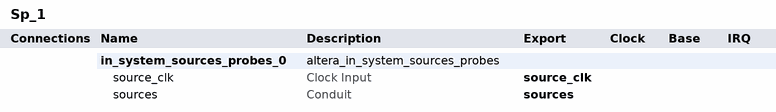
[diagram p0: system contents]
# Platform Designer (Qsys) system Sp_1, Cyclone IV E EP4CE6E22C8
# Parameters at their usual value, and those the tool derives, are not listed.
package require -exact qsys 18.1
create_system Sp_1
set_project_property DEVICE_FAMILY {Cyclone IV E}
set_project_property DEVICE EP4CE6E22C8

add_instance in_system_sources_probes_0 altera_in_system_sources_probes 18.1
set_instance_property in_system_sources_probes_0 AUTO_EXPORT true
set_instance_parameter_value in_system_sources_probes_0 create_source_clock true
set_instance_parameter_value in_system_sources_probes_0 instance_id {SP 0}
set_instance_parameter_value in_system_sources_probes_0 probe_width 0
set_instance_parameter_value in_system_sources_probes_0 source_initial_value 1
set_instance_parameter_value in_system_sources_probes_0 source_width 1

# exported interfaces
add_interface source_clk clock sink
set_interface_property source_clk EXPORT_OF in_system_sources_probes_0.source_clk
add_interface sources conduit end
set_interface_property sources EXPORT_OF in_system_sources_probes_0.sources

set_interconnect_requirement {$system} qsys_mm.clockCrossingAdapter HANDSHAKE
set_interconnect_requirement {$system} qsys_mm.enableEccProtection FALSE
set_interconnect_requirement {$system} qsys_mm.insertDefaultSlave FALSE
set_interconnect_requirement {$system} qsys_mm.maxAdditionalLatency 1

save_system Sp_1.qsys
